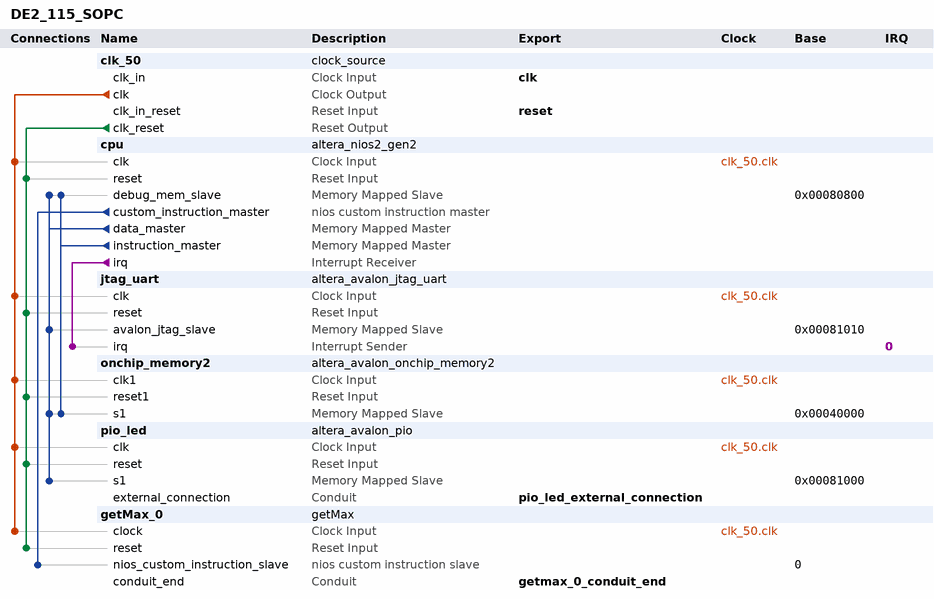
[diagram p0: system contents]
# Platform Designer (Qsys) system DE2_115_SOPC, Cyclone IV E EP4CE115F29C7
# Parameters at their usual value, and those the tool derives, are not listed.
package require -exact qsys 18.1
create_system DE2_115_SOPC
set_project_property DEVICE_FAMILY {Cyclone IV E}
set_project_property DEVICE EP4CE115F29C7

add_instance clk_50 clock_source 18.1
set_instance_parameter_value clk_50 clockFrequency 50000000

add_instance cpu altera_nios2_gen2 18.1
set_instance_parameter_value cpu dcache_size 2048
set_instance_parameter_value cpu exceptionSlave onchip_memory2.s1
set_instance_parameter_value cpu icache_size 4096
set_instance_parameter_value cpu impl Fast
set_instance_parameter_value cpu resetSlave onchip_memory2.s1

add_instance jtag_uart altera_avalon_jtag_uart 18.1
set_instance_parameter_value jtag_uart simInteractiveOptions NO_INTERACTIVE_WINDOWS

add_instance onchip_memory2 altera_avalon_onchip_memory2 18.1
set_instance_parameter_value onchip_memory2 dataWidth 32
set_instance_parameter_value onchip_memory2 dualPort false
set_instance_parameter_value onchip_memory2 initMemContent true
set_instance_parameter_value onchip_memory2 initializationFileName onchip_mem.hex
set_instance_parameter_value onchip_memory2 memorySize 204800

add_instance pio_led altera_avalon_pio 18.1
set_instance_parameter_value pio_led direction Output
set_instance_parameter_value pio_led width 8

add_instance getMax_0 getMax 1.0

# connections
add_connection clk_50.clk cpu.clk clock
add_connection clk_50.clk getMax_0.clock clock
add_connection clk_50.clk jtag_uart.clk clock
add_connection clk_50.clk onchip_memory2.clk1 clock
add_connection clk_50.clk pio_led.clk clock
add_connection clk_50.clk_reset cpu.reset reset
add_connection clk_50.clk_reset getMax_0.reset reset
add_connection clk_50.clk_reset jtag_uart.reset reset
add_connection clk_50.clk_reset onchip_memory2.reset1 reset
add_connection clk_50.clk_reset pio_led.reset reset
add_connection cpu.data_master cpu.debug_mem_slave avalon
set_connection_parameter_value cpu.data_master/cpu.debug_mem_slave baseAddress 0x00080800
add_connection cpu.data_master jtag_uart.avalon_jtag_slave avalon
set_connection_parameter_value cpu.data_master/jtag_uart.avalon_jtag_slave baseAddress 0x00081010
add_connection cpu.data_master onchip_memory2.s1 avalon
set_connection_parameter_value cpu.data_master/onchip_memory2.s1 baseAddress 0x00040000
add_connection cpu.data_master pio_led.s1 avalon
set_connection_parameter_value cpu.data_master/pio_led.s1 baseAddress 0x00081000
add_connection cpu.instruction_master cpu.debug_mem_slave avalon
set_connection_parameter_value cpu.instruction_master/cpu.debug_mem_slave baseAddress 0x00080800
add_connection cpu.instruction_master onchip_memory2.s1 avalon
set_connection_parameter_value cpu.instruction_master/onchip_memory2.s1 baseAddress 0x00040000
add_connection cpu.irq jtag_uart.irq interrupt
set_connection_parameter_value cpu.irq/jtag_uart.irq irqNumber 0
add_connection cpu.custom_instruction_master getMax_0.nios_custom_instruction_slave nios_custom_instruction
set_connection_parameter_value cpu.custom_instruction_master/getMax_0.nios_custom_instruction_slave CIName getmax_0
set_connection_parameter_value cpu.custom_instruction_master/getMax_0.nios_custom_instruction_slave baseAddress 0

# exported interfaces
add_interface clk clock sink
set_interface_property clk EXPORT_OF clk_50.clk_in
add_interface getmax_0_conduit_end conduit end
set_interface_property getmax_0_conduit_end EXPORT_OF getMax_0.conduit_end
add_interface pio_led_external_connection conduit end
set_interface_property pio_led_external_connection EXPORT_OF pio_led.external_connection
add_interface reset reset sink
set_interface_property reset EXPORT_OF clk_50.clk_in_reset

set_interconnect_requirement {$system} qsys_mm.clockCrossingAdapter HANDSHAKE
set_interconnect_requirement {$system} qsys_mm.enableEccProtection FALSE
set_interconnect_requirement {$system} qsys_mm.insertDefaultSlave FALSE
set_interconnect_requirement {$system} qsys_mm.maxAdditionalLatency 1

save_system DE2_115_SOPC.qsys
